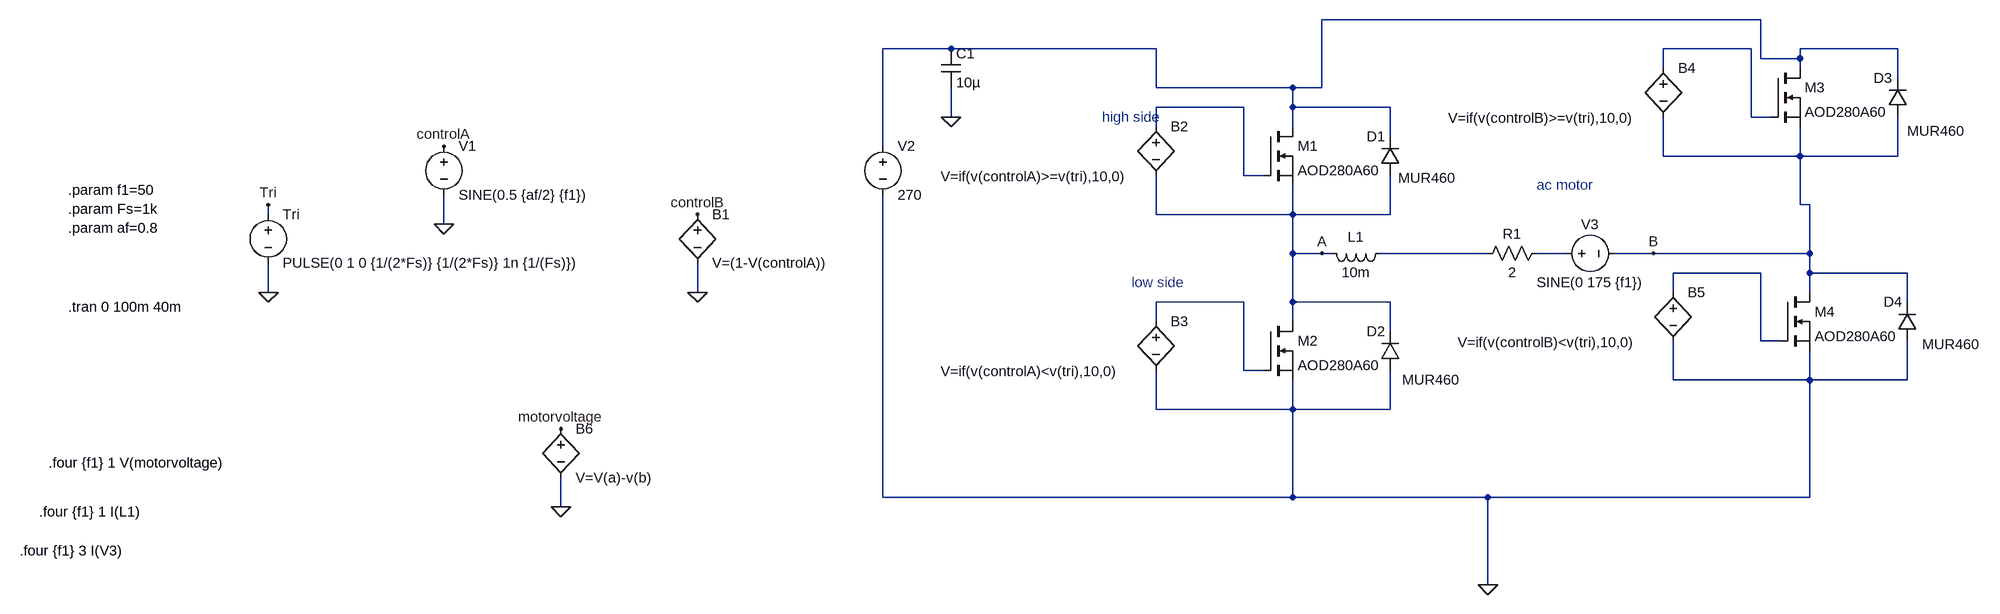
[diagram p0: schematic full bridge inverter.asc]
full bridge inverter.asc, the LTspice schematic file:
Version 4.1
SHEET 1 880 680
WIRE -336 -464 -1056 -464
WIRE -1664 -416 -1776 -416
WIRE -1328 -416 -1664 -416
WIRE -352 -416 -496 -416
WIRE -112 -416 -272 -416
WIRE -336 -400 -336 -464
WIRE -272 -400 -272 -416
WIRE -272 -400 -336 -400
WIRE -496 -384 -496 -416
WIRE -272 -384 -272 -400
WIRE -112 -368 -112 -416
WIRE -1328 -352 -1328 -416
WIRE -1104 -352 -1328 -352
WIRE -1056 -352 -1056 -464
WIRE -1056 -352 -1104 -352
WIRE -1184 -320 -1328 -320
WIRE -1104 -320 -1104 -352
WIRE -944 -320 -1104 -320
WIRE -1664 -304 -1664 -352
WIRE -352 -304 -352 -416
WIRE -320 -304 -352 -304
WIRE -1328 -288 -1328 -320
WIRE -1104 -288 -1104 -320
WIRE -944 -272 -944 -320
WIRE -1776 -256 -1776 -416
WIRE -496 -240 -496 -304
WIRE -272 -240 -272 -288
WIRE -272 -240 -496 -240
WIRE -112 -240 -112 -304
WIRE -112 -240 -272 -240
WIRE -1184 -208 -1184 -320
WIRE -1152 -208 -1184 -208
WIRE -272 -160 -272 -240
WIRE -256 -160 -272 -160
WIRE -2784 -144 -2784 -160
WIRE -1328 -144 -1328 -208
WIRE -1104 -144 -1104 -192
WIRE -1104 -144 -1328 -144
WIRE -944 -144 -944 -208
WIRE -944 -144 -1104 -144
WIRE -2496 -128 -2496 -176
WIRE -1104 -80 -1104 -144
WIRE -1056 -80 -1104 -80
WIRE -1040 -80 -1056 -80
WIRE -784 -80 -960 -80
WIRE -656 -80 -704 -80
WIRE -512 -80 -576 -80
WIRE -256 -80 -256 -160
WIRE -256 -80 -512 -80
WIRE -336 -48 -480 -48
WIRE -256 -48 -256 -80
WIRE -96 -48 -256 -48
WIRE -2784 -16 -2784 -64
WIRE -2080 -16 -2080 -64
WIRE -480 -16 -480 -48
WIRE -256 -16 -256 -48
WIRE -1184 0 -1328 0
WIRE -1104 0 -1104 -80
WIRE -944 0 -1104 0
WIRE -96 0 -96 -48
WIRE -1328 32 -1328 0
WIRE -1104 32 -1104 0
WIRE -944 48 -944 0
WIRE -336 64 -336 -48
WIRE -304 64 -336 64
WIRE -1184 112 -1184 0
WIRE -1152 112 -1184 112
WIRE -480 128 -480 64
WIRE -256 128 -256 80
WIRE -256 128 -480 128
WIRE -96 128 -96 64
WIRE -96 128 -256 128
WIRE -1328 176 -1328 112
WIRE -1104 176 -1104 128
WIRE -1104 176 -1328 176
WIRE -944 176 -944 112
WIRE -944 176 -1104 176
WIRE -1776 320 -1776 -176
WIRE -1104 320 -1104 176
WIRE -1104 320 -1776 320
WIRE -784 320 -1104 320
WIRE -256 320 -256 128
WIRE -256 320 -784 320
WIRE -2304 336 -2304 288
WIRE -784 464 -784 320
FLAG -2784 -16 0
FLAG -2496 -128 0
FLAG -2080 -16 0
FLAG -2496 -256 controlA
FLAG -2080 -144 controlB
FLAG -2784 -160 Tri
FLAG -784 464 0
FLAG -1664 -304 0
FLAG -1056 -80 A
FLAG -512 -80 B
FLAG -2304 336 0
FLAG -2304 208 motorvoltage
SYMBOL voltage -2784 -160 R0
WINDOW 123 0 0 Left 0
WINDOW 39 0 0 Left 0
SYMATTR InstName Tri
SYMATTR Value PULSE(0 1 0 {1/(2*Fs)} {1/(2*Fs)} 1n {1/(Fs)})
SYMBOL voltage -2496 -272 R0
WINDOW 123 0 0 Left 0
WINDOW 39 0 0 Left 0
SYMATTR InstName V1
SYMATTR Value SINE(0.5 {af/2} {f1})
SYMBOL bv -2080 -160 R0
SYMATTR InstName B1
SYMATTR Value V=(1-V(controlA))
SYMBOL bv -1328 -304 R0
WINDOW 3 -353 98 Left 2
SYMATTR InstName B2
SYMATTR Value V=if(v(controlA)>=v(tri),10,0)
SYMBOL nmos -1152 -288 R0
SYMATTR InstName M1
SYMATTR Value AOD280A60
SYMBOL diode -928 -208 R180
WINDOW 0 24 64 Left 2
WINDOW 3 -92 -4 Left 2
SYMATTR InstName D1
SYMATTR Value MUR460
SYMBOL voltage -1776 -272 R0
WINDOW 123 0 0 Left 0
WINDOW 39 0 0 Left 0
SYMATTR InstName V2
SYMATTR Value 270
SYMBOL bv -1328 16 R0
WINDOW 3 -353 98 Left 2
SYMATTR InstName B3
SYMATTR Value V=if(v(controlA)<v(tri),10,0)
SYMBOL nmos -1152 32 R0
SYMATTR InstName M2
SYMATTR Value AOD280A60
SYMBOL diode -928 112 R180
WINDOW 0 24 64 Left 2
WINDOW 3 -99 -16 Left 2
SYMATTR InstName D2
SYMATTR Value MUR460
SYMBOL bv -496 -400 R0
WINDOW 3 -353 98 Left 2
SYMATTR InstName B4
SYMATTR Value V=if(v(controlB)>=v(tri),10,0)
SYMBOL nmos -320 -384 R0
SYMATTR InstName M3
SYMATTR Value AOD280A60
SYMBOL diode -96 -304 R180
WINDOW 0 24 64 Left 2
WINDOW 3 -95 -23 Left 2
SYMATTR InstName D3
SYMATTR Value MUR460
SYMBOL bv -480 -32 R0
WINDOW 3 -353 98 Left 2
SYMATTR InstName B5
SYMATTR Value V=if(v(controlB)<v(tri),10,0)
SYMBOL nmos -304 -16 R0
SYMATTR InstName M4
SYMATTR Value AOD280A60
SYMBOL diode -80 64 R180
WINDOW 0 24 64 Left 2
WINDOW 3 -104 -5 Left 2
SYMATTR InstName D4
SYMATTR Value MUR460
SYMBOL res -688 -96 R90
WINDOW 0 0 56 VBottom 2
WINDOW 3 32 56 VTop 2
SYMATTR InstName R1
SYMATTR Value 2
SYMBOL ind -944 -96 R90
WINDOW 0 5 56 VBottom 2
WINDOW 3 32 56 VTop 2
SYMATTR InstName L1
SYMATTR Value 10m
SYMATTR SpiceLine Rser=1m
SYMBOL cap -1680 -416 R0
SYMATTR InstName C1
SYMATTR Value 10µ
SYMBOL voltage -672 -80 R270
WINDOW 0 32 56 VTop 2
WINDOW 3 -32 56 VBottom 2
WINDOW 123 0 0 Left 0
WINDOW 39 0 0 Left 0
SYMATTR InstName V3
SYMATTR Value SINE(0 175 {f1})
SYMBOL bv -2304 192 R0
SYMATTR InstName B6
SYMATTR Value V=V(a)-v(b)
TEXT -3112 -184 Left 2 !.param f1=50 \n.param Fs=1k\n.param af=0.8
TEXT -3112 8 Left 2 !.tran 0 100m 40m
TEXT -1416 -304 Left 2 ;high side
TEXT -1368 -32 Left 2 ;low side
TEXT -704 -192 Left 2 ;ac motor
TEXT -3144 264 Left 2 !.four {f1} 1 V(motorvoltage)
TEXT -3160 344 Left 2 !.four {f1} 1 I(L1)
TEXT -3192 408 Left 2 !.four {f1} 3 I(V3)

The netlist it stands for:
* full bridge inverter.asc
V§Tri Tri 0 PULSE(0 1 0 {1/(2*Fs)} {1/(2*Fs)} 1n {1/(Fs)})
V1 controlA 0 SINE(0.5 {af/2} {f1})
B1 controlB 0 V=(1-V(controlA))
B2 N003 A V=if(v(controlA)>=v(tri),10,0)
M1 N001 N003 A A AOD280A60
D1 A N001 MUR460
V2 N001 0 270
B3 N007 0 V=if(v(controlA)<v(tri),10,0)
M2 A N007 0 0 AOD280A60
D2 0 A MUR460
B4 N002 B V=if(v(controlB)>=v(tri),10,0)
M3 N001 N002 B B AOD280A60
D3 B N001 MUR460
B5 N006 0 V=if(v(controlB)<v(tri),10,0)
M4 B N006 0 0 AOD280A60
D4 0 B MUR460
R1 N005 N004 2
L1 N004 A 10m Rser=1m
C1 N001 0 10µ
V3 N005 B SINE(0 175 {f1})
B6 motorvoltage 0 V=V(a)-v(b)
.model D D
.lib standard.dio
.model NMOS NMOS
.model PMOS PMOS
.lib standard.mos
.param f1=50
.param Fs=1k
.param af=0.8
.tran 0 100m 40m
* high side
* low side
* ac motor
.four {f1} 1 V(motorvoltage)
.four {f1} 1 I(L1)
.four {f1} 3 I(V3)
.backanno
.end